# EAGLE design dabper (EAGLE 6.6.0)
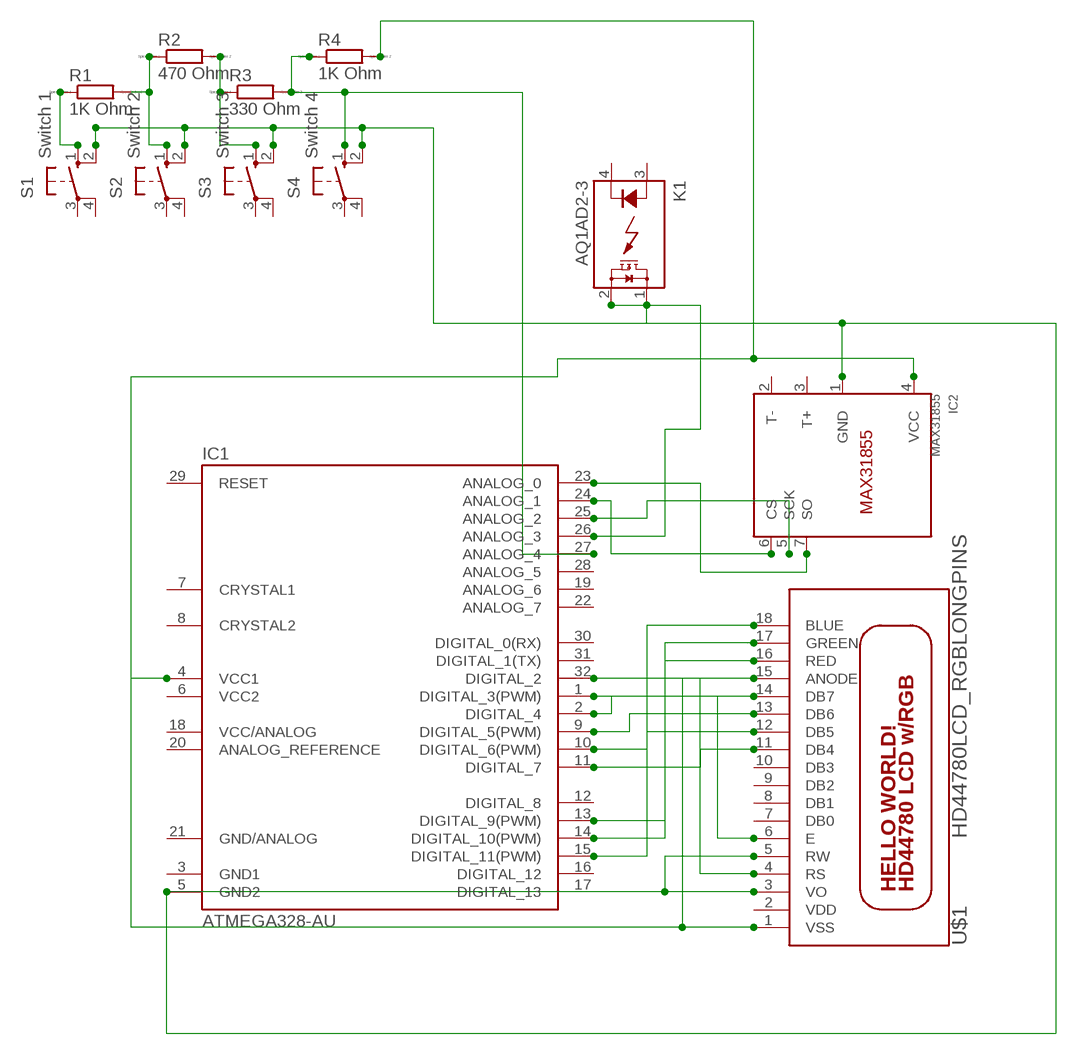
[diagram p0: schematic, sheet 1]

## Parts
IC1  ATMEGA328-AU  [TQFP32-08]
IC2  MAX31855  [SOIC8]
K1  AQ1AD2-3  [AQ1]
R1  1K Ohm  RR5025  [R5025]
R2  470 Ohm  RR5025  [R5025]
R3  330 Ohm  RR5025  [R5025]
R4  1K Ohm  RR5025  [R5025]
S1  Switch 1  10-XX  [B3F-10XX]
S2  Switch 2  10-XX  [B3F-10XX]
S3  Switch 3  10-XX  [B3F-10XX]
S4  Switch 4  10-XX  [B3F-10XX]
U$1  HD44780LCD_RGBLONGPINS  [LCD1602-RGB]

## Nets
N$1: IC1.27(ANALOG_4) R3.2 R4.1 S4.1(S)
N$2: R2.2 R3.1 S3.1(S)
N$3: R1.2 R2.1 S2.1(S)
N$4: R1.1 S1.1(S)
N$5: IC1.5(GND2) IC2.1(GND) S1.2(S1) S2.2(S1) S3.2(S1) S4.2(S1) U$1.3(VO) U$1.5(RW)
N$6: IC1.23(ANALOG_0) IC2.7(SO)
N$7: IC1.25(ANALOG_2) IC2.5(SCK)
N$8: IC1.24(ANALOG_1) IC2.6(CS)
N$9: IC1.10(DIGITAL_6(PWM)) IC1.15(DIGITAL_11(PWM)) U$1.12(DB5) U$1.18(BLUE)
N$10: IC1.13(DIGITAL_9(PWM)) IC1.14(DIGITAL_10(PWM)) U$1.16(RED) U$1.17(GREEN)
N$11: IC1.1(DIGITAL_3(PWM)) IC1.2(DIGITAL_4) U$1.6(E) U$1.14(DB7)
N$12: IC1.9(DIGITAL_5(PWM)) U$1.13(DB6)
N$13: IC1.11(DIGITAL_7) U$1.11(DB4)
N$14: K1.1(DS1)
N$15: IC1.26(ANALOG_3) K1.2(DS2)
VSS: IC1.4(VCC1) IC1.32(DIGITAL_2) IC2.4(VCC) R4.2 U$1.1(VSS) U$1.4(RS) U$1.15(ANODE)
Unconnected: IC1.7(CRYSTAL1) IC1.8(CRYSTAL2) IC1.12(DIGITAL_8) IC1.16(DIGITAL_12) IC1.17(DIGITAL_13) IC1.18(VCC/ANALOG) IC1.19(ANALOG_6) IC1.20(ANALOG_REFERENCE) IC1.22(ANALOG_7) IC1.28(ANALOG_5) IC1.29(RESET) IC1.30(DIGITAL_0(RX)) IC1.31(DIGITAL_1(TX)) IC2.2(T-) IC2.3(T+) K1.3(A) K1.4(K) S1.3(P) S1.4(P1) S2.3(P) S2.4(P1) S3.3(P) S3.4(P1) S4.3(P) S4.4(P1) U$1.2(VDD) U$1.7(DB0) U$1.8(DB1) U$1.9(DB2) U$1.10(DB3)

## Power pins joined to a net without a drawn wire
GND1: IC1.3(GND1)
GND/ANALOG: IC1.21(GND/ANALOG)
VCC2: IC1.6(VCC2)

## Library data of the parts
IC1 = Arduino-AVR:ATMEGA328
IC2 = AlexW-Eagle-Libraries:MAX31855
K1 = relay:AQ*: SOLID STATE RELAY NAiS Source: http://www.mew-europe.com/.. en_ds_61601_0000.pdf; MF: AROMAT/ MATSUSHITA; MPN: AQ1AD2-3/28VDC; OC_FARNELL: unknown; OC_NEWARK: 10C4052
R1-R4 = eagle-ltspice:R: RESISTOR, European symbol; SPICEMODEL: NONE; SPICEPREFIX: R
S1-S4 = switch-omron:10-XX: OMRON SWITCH; MPN: B3F-1000; OC_FARNELL: 176432; OC_NEWARK: 36M3542
U$1 = adafruit:HD44780LCD_RGB

## Board
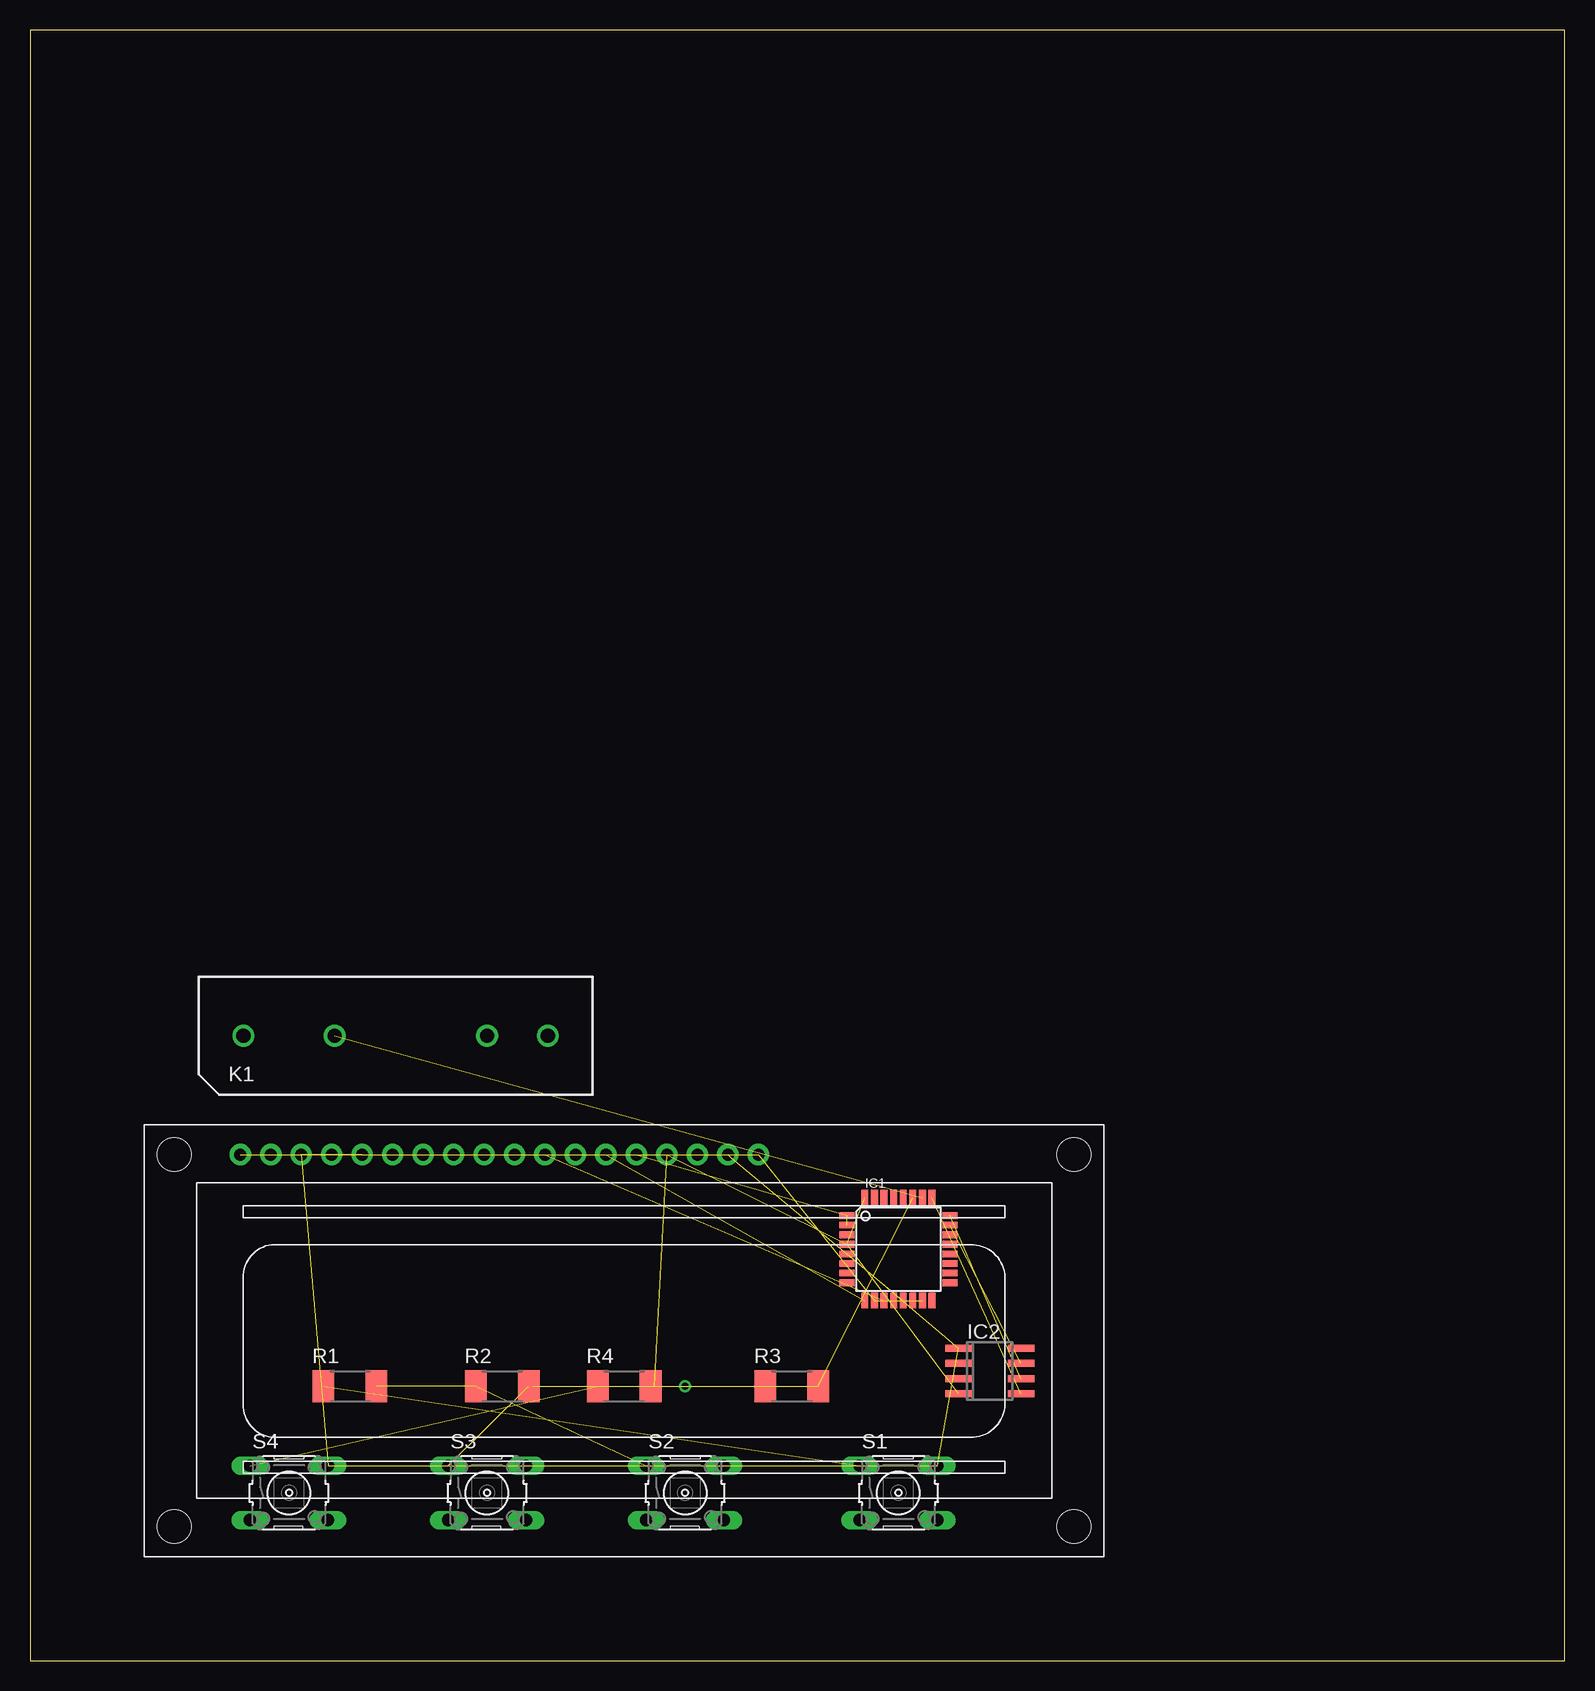
[diagram p1: board, top side]

Size 127.94 x 135.88 mm. Coordinates in mm from the lower left corner, seen from the top.
Outline: 0,0 127.94,0 127.94,135.88 0,135.88 0,0
Copper layers (1*16): Top 0.035mm / dielectric 1.5mm / Bottom 0.035mm
Design rules "default": minimum track width 10mil, minimum drill 24mil, track to track 8mil, track to pad 8mil, pad to pad 8mil, via to via 8mil, smd to smd 8mil, copper to edge 40mil, drill to drill 8mil, minimum pad ring 10mil, minimum via ring 8mil, stop-mask expansion 4mil, vias tented up to drill 0mil, thermal gap 10mil

### Footprints (pad centres in the part's own frame; a part is rotated, then mirrored left to right if it is on the bottom)
TQFP32-08 = smd 1.27 x 0.559: 1 -4.293,2.8; 2 -4.293,2; 3 -4.293,1.2; 4 -4.293,0.4; 5 -4.293,-0.4; 6 -4.293,-1.2; 7 -4.293,-2; 8 -4.293,-2.8; 17 4.293,-2.8; 18 4.293,-2; 19 4.293,-1.2; 20 4.293,-0.4; 21 4.293,0.4; 22 4.293,1.2; 23 4.293,2; 24 4.293,2.8 | smd 0.559 x 1.27: 9 -2.8,-4.293; 10 -2,-4.293; 11 -1.2,-4.293; 12 -0.4,-4.293; 13 0.4,-4.293; 14 1.2,-4.293; 15 2,-4.293; 16 2.8,-4.293; 25 2.8,4.293; 26 2,4.293; 27 1.2,4.293; 28 0.4,4.293; 29 -0.4,4.293; 30 -1.2,4.293; 31 -2,4.293; 32 -2.8,4.293
SOIC8 = smd 0.6 x 2.2: 1 -1.905,-2.6; 2 -0.635,-2.6; 3 0.635,-2.6; 4 1.905,-2.6; 5 1.905,2.6; 6 0.635,2.6; 7 -0.635,2.6; 8 -1.905,2.6
AQ1 = drill 1.2: 1 -12.7,0; 2 -5.08,0; 3 7.62,0; 4 12.7,0
R5025 = smd 1.8 x 2.7: 1 -2.2,0; 2 2.2,0
B3F-10XX = drill 1.016 long: 1 -3.251,2.261; 2 3.251,2.261; 3 -3.251,-2.261; 4 3.251,-2.261
LCD1602-RGB = drill 1 pad 1.778: 1 -32,15.5; 2 -29.46,15.5; 3 -26.92,15.5; 4 -24.38,15.5; 5 -21.84,15.5; 6 -19.3,15.5; 7 -16.76,15.5; 8 -14.22,15.5; 9 -11.68,15.5; 10 -9.14,15.5; 11 -6.6,15.5; 12 -4.06,15.5; 13 -1.52,15.5; 14 1.02,15.5; 15 3.56,15.5; 16 6.1,15.5; 17 8.64,15.5; 18 11.18,15.5 | hole 2.8: -37.5,-15.5; -37.5,15.5; 37.5,15.5; 37.5,-15.5

### Placement (x,y rotation side)
IC1  72.39,34.29 0 top
IC2  80.01,24.13 270 top
K1  30.48,52.07 0 top
R1  26.67,22.86 0 top
R2  39.37,22.86 0 top
R3  63.5,22.86 0 top
R4  49.53,22.86 0 top
S1  72.39,13.97 0 top
S2  54.61,13.97 0 top
S3  38.1,13.97 0 top
S4  21.59,13.97 0 top
U$1  49.53,26.67 0 top

### Tracks (layer width: path | path; a pad name or v marks a point on that pad's centre or on a via)
N$1  (3 unrouted)
N$2  (via drill 0.61)  (3 unrouted)
  Top 0.254: 41.91,22.86 R2.2
  other vias: 54.61,22.86
N$3  (2 unrouted)
N$4  (1 unrouted)
N$5  (7 unrouted)
N$6  (1 unrouted)
N$7  (1 unrouted)
N$8  (1 unrouted)
N$9  (3 unrouted)
N$10  (4 unrouted)
N$11  (3 unrouted)
N$12  (1 unrouted)
N$13  (1 unrouted)
N$15  (1 unrouted)
VSS  (6 unrouted)
  Top 0.254: 52.07,22.86 R4.2